# EAGLE schematic Platine (EAGLE 9.6.2)
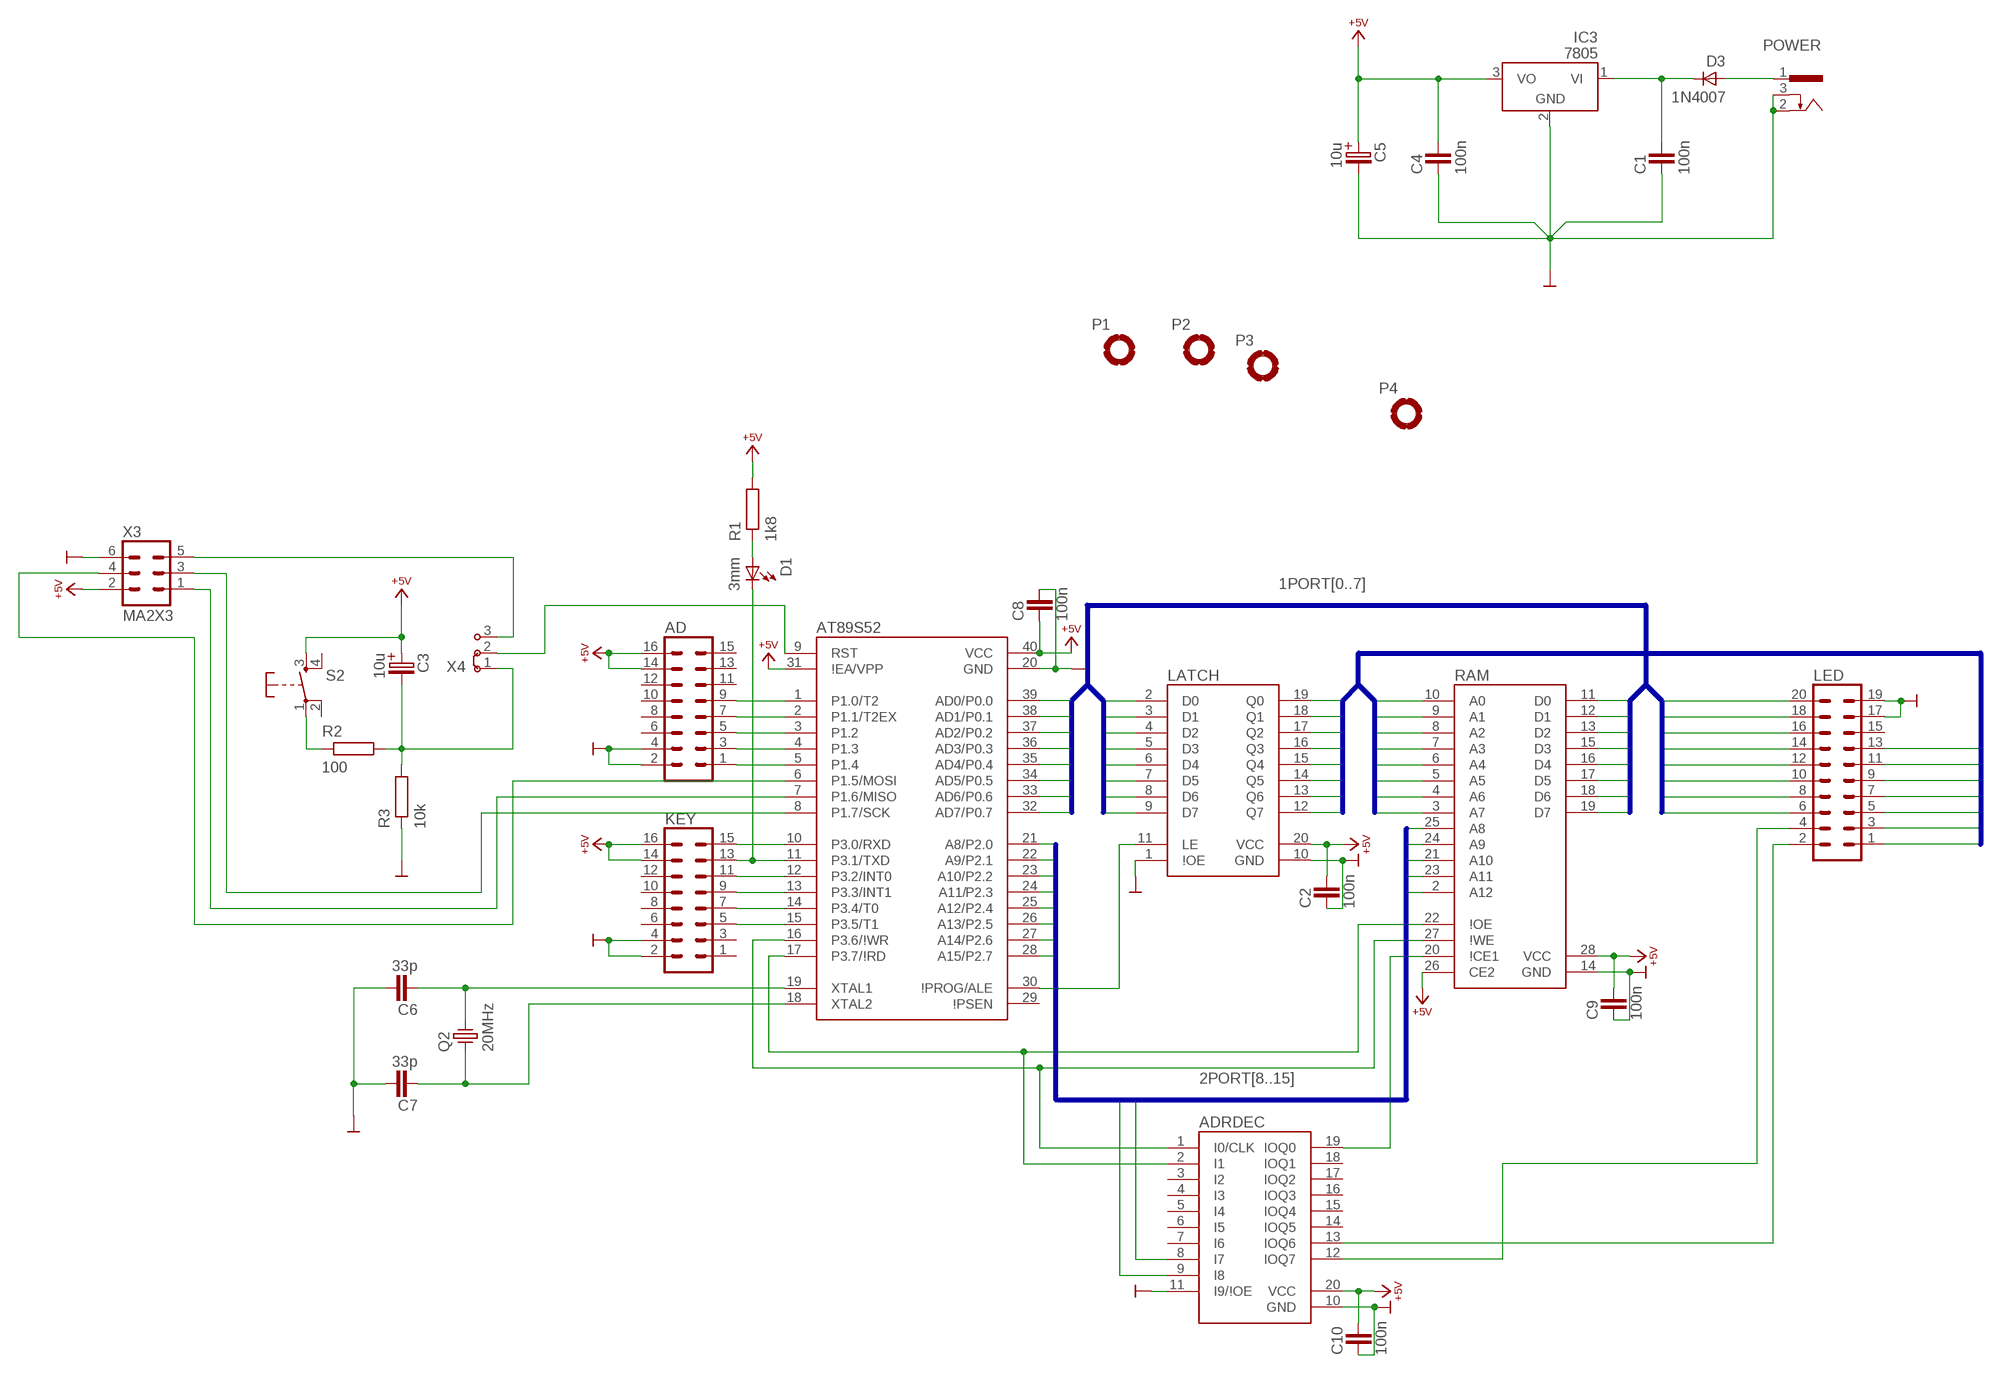
[diagram p0: schematic, sheet 1]

## Parts
AD  MA8X2  [MA8X2]
ADRDEC  16V8  [DIL20]
AT89S52  AT89S52  [DIL40]
C1  100n  C-2,5  [C-2,5]
C2  100n  C-2,5  [C-2,5]
C3  10u  ELKO-2,5  [ELKO-2,5]
C4  100n  C-2,5  [C-2,5]
C5  10u  ELKO-2,5  [ELKO-2,5]
C6  33p  C-2,5  [C-2,5]
C7  33p  C-2,5  [C-2,5]
C8  100n  C-2,5  [C-2,5]
C9  100n  C-2,5  [C-2,5]
C10  100n  C-2,5  [C-2,5]
D1  3mm  LED3-2,5  [LED3-2,5]
D3  1N4007  1N4007-10  [DO41-10]
IC3  7805  [TO220V]
KEY  MA8X2  [MA8X2]
LATCH  74573  [DIL20]
LED  MA10X2  [MA10X2]
P1  MPAD-3,0  [MPAD-3,0]
P2  MPAD-3,0  [MPAD-3,0]
P3  MPAD-3,0  [MPAD-3,0]
P4  MPAD-3,0  [MPAD-3,0]
POWER  PWRCON-HEBW21  [HEBW21]
Q2  20MHz  Q-HC49U  [HC49U]
R1  1k8  R-10  [R-10]
R2  100  R-10  [R-10]
R3  10k  R-10  [R-10]
RAM  6264  [DIL28]
S2  KEY-3301  [T3301]
X3  MA2X3  MA3X2  [MA3X2]
X4  J1X3  [J1X3]

## Nets
1PORT0: AT89S52.39(P0.0) LATCH.2(D0) LED.20 RAM.11(D0)
1PORT1: AT89S52.38(P0.1) LATCH.3(D1) LED.18 RAM.12(D1)
1PORT2: AT89S52.37(P0.2) LATCH.4(D2) LED.16 RAM.13(D2)
1PORT3: AT89S52.36(P0.3) LATCH.5(D3) LED.14 RAM.15(D3)
1PORT4: AT89S52.35(P0.4) LATCH.6(D4) LED.12 RAM.16(D4)
1PORT5: AT89S52.34(P0.5) LATCH.7(D5) LED.10 RAM.17(D5)
1PORT6: AT89S52.33(P0.6) LATCH.8(D6) LED.8 RAM.18(D6)
1PORT7: AT89S52.32(P0.7) LATCH.9(D7) LED.6 RAM.19(D7)
2PORT8: ADRDEC.9(I8) AT89S52.21(P2.0) RAM.25(A8)
2PORT9: ADRDEC.8(I7) AT89S52.22(P2.1) RAM.24(A9)
2PORT10: AT89S52.23(P2.2) RAM.21(A10)
2PORT11: AT89S52.24(P2.3) RAM.23(A11)
2PORT12: AT89S52.25(P2.4) RAM.2(A12)
2PORT13: AT89S52.26(P2.5)
2PORT14: AT89S52.27(P2.6)
2PORT15: AT89S52.28(P2.7)
+5V: AD.14 AD.16 ADRDEC.20(VCC) AT89S52.31(\!EA) AT89S52.40(VCC) C2.2 C3.+ C4.2 C5.+ C8.1 C9.2 C10.2 IC3.3(VO) KEY.14 KEY.16 LATCH.20(VCC) R1.2 RAM.26(CE2) RAM.28(VCC) S2.3(S) X3.2
A0: LATCH.19(Q0) LED.13 RAM.10(A0)
A1: LATCH.18(Q1) LED.11 RAM.9(A1)
A2: LATCH.17(Q2) LED.9 RAM.8(A2)
A3: LATCH.16(Q3) LED.7 RAM.7(A3)
A4: LATCH.15(Q4) LED.5 RAM.6(A4)
A5: LATCH.14(Q5) LED.3 RAM.5(A5)
A6: LATCH.13(Q6) LED.1 RAM.4(A6)
A7: LATCH.12(Q7) RAM.3(A7)
GND: AD.2 AD.4 ADRDEC.10(GND) ADRDEC.11(I9/\!OE) AT89S52.20(GND) C1.1 C2.1 C4.1 C5.- C6.2 C7.2 C8.2 C9.1 C10.1 IC3.2(GND) KEY.2 KEY.4 LATCH.1(\!OE) LATCH.10(GND) LED.17 LED.19 POWER.2 POWER.3 R3.1 RAM.14(GND) X3.6
N$1: AT89S52.9(RST) X4.2
N$2: R2.1 S2.1(P)
N$3: C3.- R2.2 R3.2 X4.1
N$4: X3.5 X4.3
N$5: D3.A POWER.1
N$6: C1.2 D3.C IC3.1(VI)
N$7: AT89S52.19(XTAL1) C6.1 Q2.2
N$8: AT89S52.10(P3.0) KEY.15
N$9: AT89S52.18(XTAL2) C7.1 Q2.1
N$10: AT89S52.8(P1.7) X3.3
N$11: AT89S52.7(P1.6) X3.1
N$12: AT89S52.6(P1.5) X3.4
N$13: AT89S52.11(P3.1) D1.C KEY.13
N$14: AT89S52.12(P3.2) KEY.11
N$15: AT89S52.13(P3.3) KEY.9
N$16: AT89S52.14(P3.4) KEY.7
N$17: AT89S52.15(P3.5) KEY.5
N$18: AD.1 AT89S52.5(P1.4)
N$19: AD.3 AT89S52.4(P1.3)
N$20: AD.5 AT89S52.3(P1.2)
N$21: AD.7 AT89S52.2(P1.1)
N$22: AD.9 AT89S52.1(P1.0)
N$23: D1.A R1.1
N$32: ADRDEC.2(I1) AT89S52.17(P3.7) RAM.22(\!OE)
N$33: ADRDEC.1(I0/CLK) AT89S52.16(P3.6) RAM.27(\!WE)
N$34: ADRDEC.19(IOQ0) RAM.20(\!CE1)
N$35: ADRDEC.12(IOQ7) LED.4
N$36: ADRDEC.13(IOQ6) LED.2
N$41: AT89S52.30(ALE) LATCH.11(LE)
Unconnected: AD.6 AD.8 AD.10 AD.11 AD.12 AD.13 AD.15 ADRDEC.3(I2) ADRDEC.4(I3) ADRDEC.5(I4) ADRDEC.6(I5) ADRDEC.7(I6) ADRDEC.14(IOQ5) ADRDEC.15(IOQ4) ADRDEC.16(IOQ3) ADRDEC.17(IOQ2) ADRDEC.18(IOQ1) AT89S52.29(\!PSEN) KEY.1 KEY.3 KEY.6 KEY.8 KEY.10 KEY.12 LED.15 P1.B3,0(MOUNT) P2.B3,0(MOUNT) P3.B3,0(MOUNT) P4.B3,0(MOUNT) S2.2(P) S2.4(S)

## Buses
2PORT[8..15]
1PORT[0..7]
A[0..7]

## Library data of the parts
AD KEY = 89S52mini:MA8X2
ADRDEC = 89S52mini:16V8
AT89S52 = 89S52mini:AT89S52
C1 C2 C4 C6-C10 = 89S52mini:C-2,5
C3 C5 = 89S52mini:ELKO-2,5
D1 = 89S52mini:LED3-2,5
D3 = 89S52mini:1N4007-10
IC3 = 89S52mini:7805
LATCH = 89S52mini:74573
LED = 89S52mini:MA10X2
P1-P4 = 89S52mini:MPAD-3,0
POWER = 89S52mini:PWRCON-HEBW21
Q2 = 89S52mini:Q-HC49U
R1-R3 = 89S52mini:R-10
RAM = 89S52mini:6264
S2 = 89S52mini:KEY-3301
X3 = 89S52mini:MA3X2
X4 = 89S52mini:J1X3